# EAGLE design ledStripSimple (EAGLE 8.4.3)
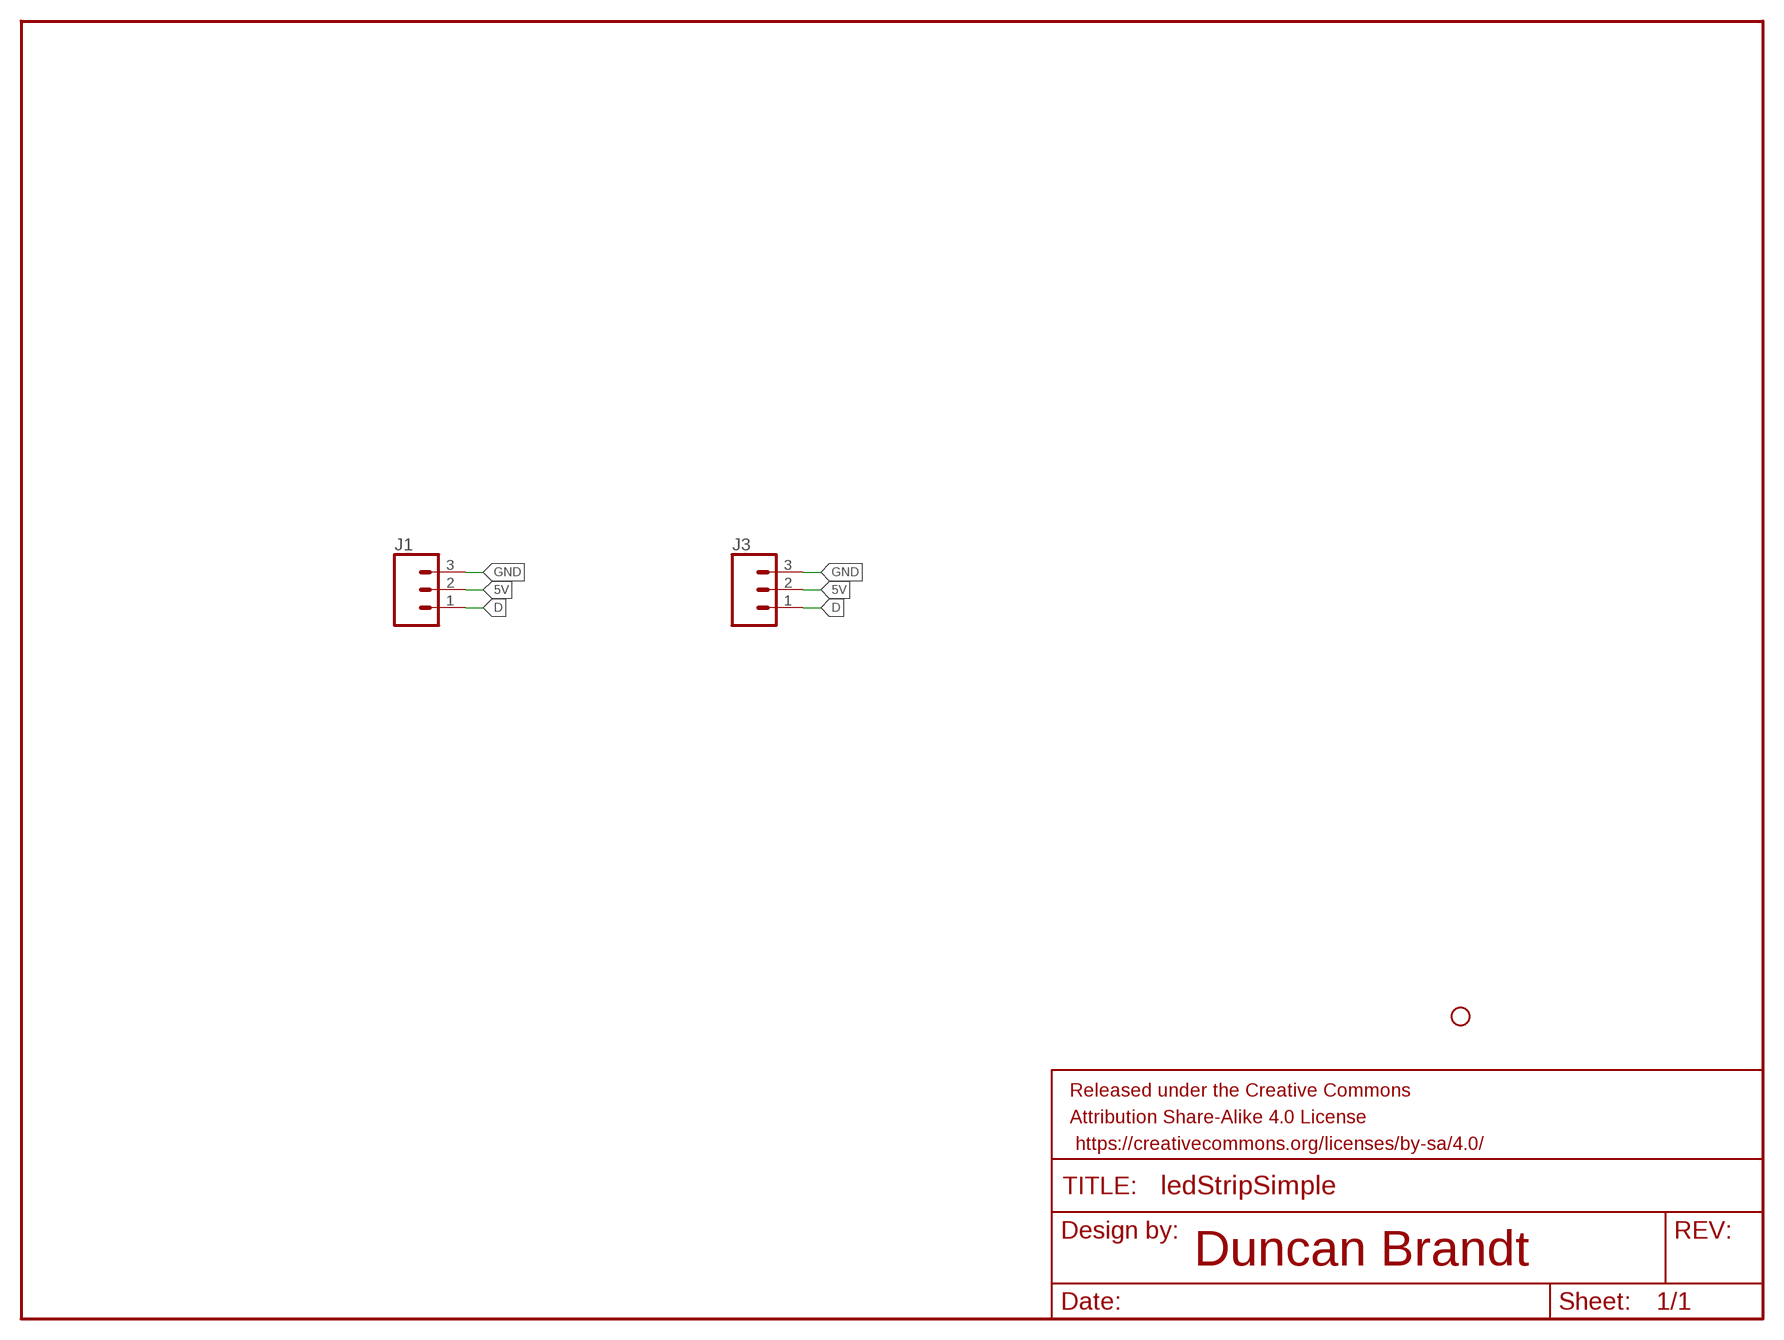
[diagram p0: schematic, sheet 1]

## Parts
FRAME1  FRAME-LETTER  [CREATIVE_COMMONS]
H2  STAND-OFF  [STAND-OFF]
J1  CONN_03LONGPADS  [1X03_LEDSTRIP_LONGPADS]
J3  CONN_03  [1X03]

## Nets
5V: J1.2 J3.2
D: J1.1 J3.1
GND: J1.3 J3.3

## Notes on the sheet
- Duncan Brandt

## Library data of the parts
FRAME1 = DB-SYMBOLS:FRAME-LETTER: Schematic Frame - Letter Standard 8.5x11 US Letter frame
H2 = DB-HARDWARE:STAND-OFF: #4 Phillips Hole Screw Hole Mount Hole DB BOARDS: DB Drawing Board <www.dbboards.com>
J1 J3 = DB-CONN:CONN_03: 3 Pin Headers Single connection point. Often used as Generic Header-pin footprint for 0.1 inch spaced/style header connections DB BOARDS: DB LED Strip Boards <www.dbboards.com>

## Board
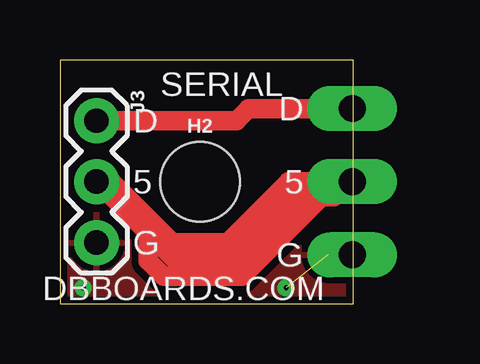
[diagram p1: board, top side]
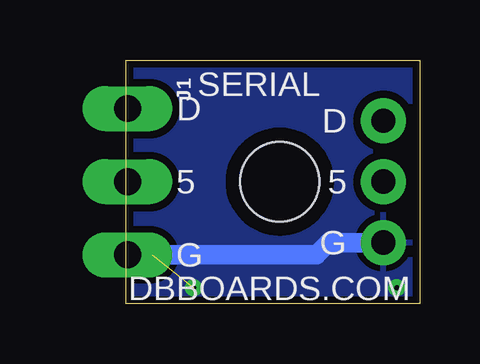
[diagram p2: board, bottom side, seen from below]

Size 12.24 x 10.15 mm. Coordinates in mm from the lower left corner, seen from the top.
Outline: 0,0 12.24,0 12.24,10.15 0,10.15 0,0
Copper layers (1*16): Top 0.035mm / dielectric 1.5mm / Bottom 0.035mm
Design rules "SparkFun-2-layer-STANDARD": minimum track width 10mil, minimum drill 20mil, track to track 10mil, track to pad 8mil, pad to pad 8mil, via to via 10mil, smd to smd 8mil, copper to edge 8mil, drill to drill 8mil, minimum pad ring 10mil, minimum via ring 10mil, stop-mask expansion 4mil, vias tented up to drill 25mil, thermal gap 10mil

### Footprints (pad centres in the part's own frame; a part is rotated, then mirrored left to right if it is on the bottom)
STAND-OFF = hole 3.302: 0,0
1X03_LEDSTRIP_LONGPADS = drill 1.118 pad 1.88 long: 1 0,0; 2 3.048,0; 3 6.096,0
1X03 = drill 1.016 pad 1.88: 1 0,0; 2 2.54,0; 3 5.08,0

### Placement (x,y rotation side)
FRAME1  -101.6,1.27 0 top  (outside the outline)
H2  5.84,5.08 0 top
J1  12.19,8.13 270 bottom
J3  1.52,7.62 270 top

### Tracks (layer width: path | path; a pad name or v marks a point on that pad's centre or on a via)
5V
  Top 0.813: 10.16,5.08 11.63,5.08 11.56,5.08 7.62,1.14 4.32,1.14 3.68,1.78 3.68,2.92 | 10.16,5.08 9.53,5.08 6.99,2.54 4.7,2.54 2.16,5.08 J3.2 4.83,1.78 7.24,1.78 9.91,4.45 11.43,4.45 | 11.43,4.45 11.63,4.65 | 11.43,4.45 12.06,5.08 J1.2 10.16,5.08
D
  Top 0.813: J3.1 7.37,7.62 7.87,8.13 10.41,8.13 | 10.41,8.13 11.63,8.13 | J1.1 10.41,8.13
GND  (via drill 0.2)  (1 unrouted)
  Bottom 0.813: J3.3 3.81,2.54 4.32,2.03 11.18,2.03 | 11.18,2.03 11.63,2.03 | J1.3 11.18,2.03
  other vias: 0.97,0.66 9.44,0.66
  pour Bottom (isolate 0.305): 0,10.16 12.19,10.16 12.19,0 0,0
  pour Top (isolate 0.305): 0,10.16 12.19,10.16 12.19,0 0,0

### Text on the board
tPlace: SERIAL | D | D | 5 | 5 | G | G | DBBOARDS.COM
bPlace: SERIAL | D | D | 5 | 5 | G | G | DBBOARDS.COM